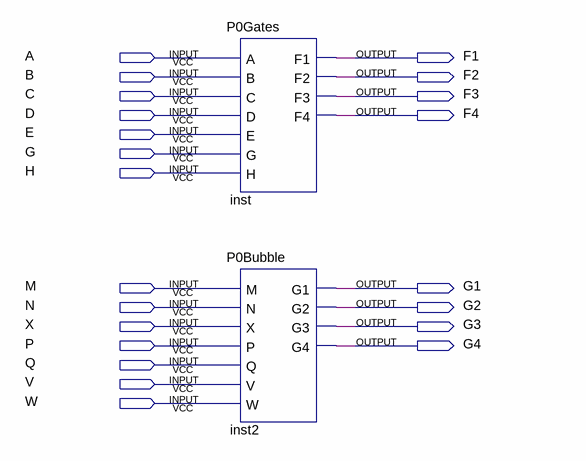
[diagram p0: schematic sheet]
// Quartus schematic P0Simulation.bdf as structural Verilog: 2 symbols, 22 pins
module P0Simulation (
  input  A,
  input  B,
  input  C,
  input  D,
  input  E,
  input  G,
  input  H,
  input  M,
  input  N,
  input  X,
  input  P,
  input  Q,
  input  V,
  input  W,
  output F1,
  output F2,
  output F3,
  output F4,
  output G1,
  output G2,
  output G3,
  output G4
);

  P0Gates inst (.A(A), .B(B), .C(C), .D(D), .E(E), .G(G), .H(H), .F1(F1), .F2(F2), .F3(F3), .F4(F4));
  P0Bubble inst2 (.M(M), .N(N), .X(X), .P(P), .Q(Q), .V(V), .W(W), .G1(G1), .G2(G2), .G3(G3), .G4(G4));
endmodule
